# EAGLE design fMeter-preamp (EAGLE 5.07)
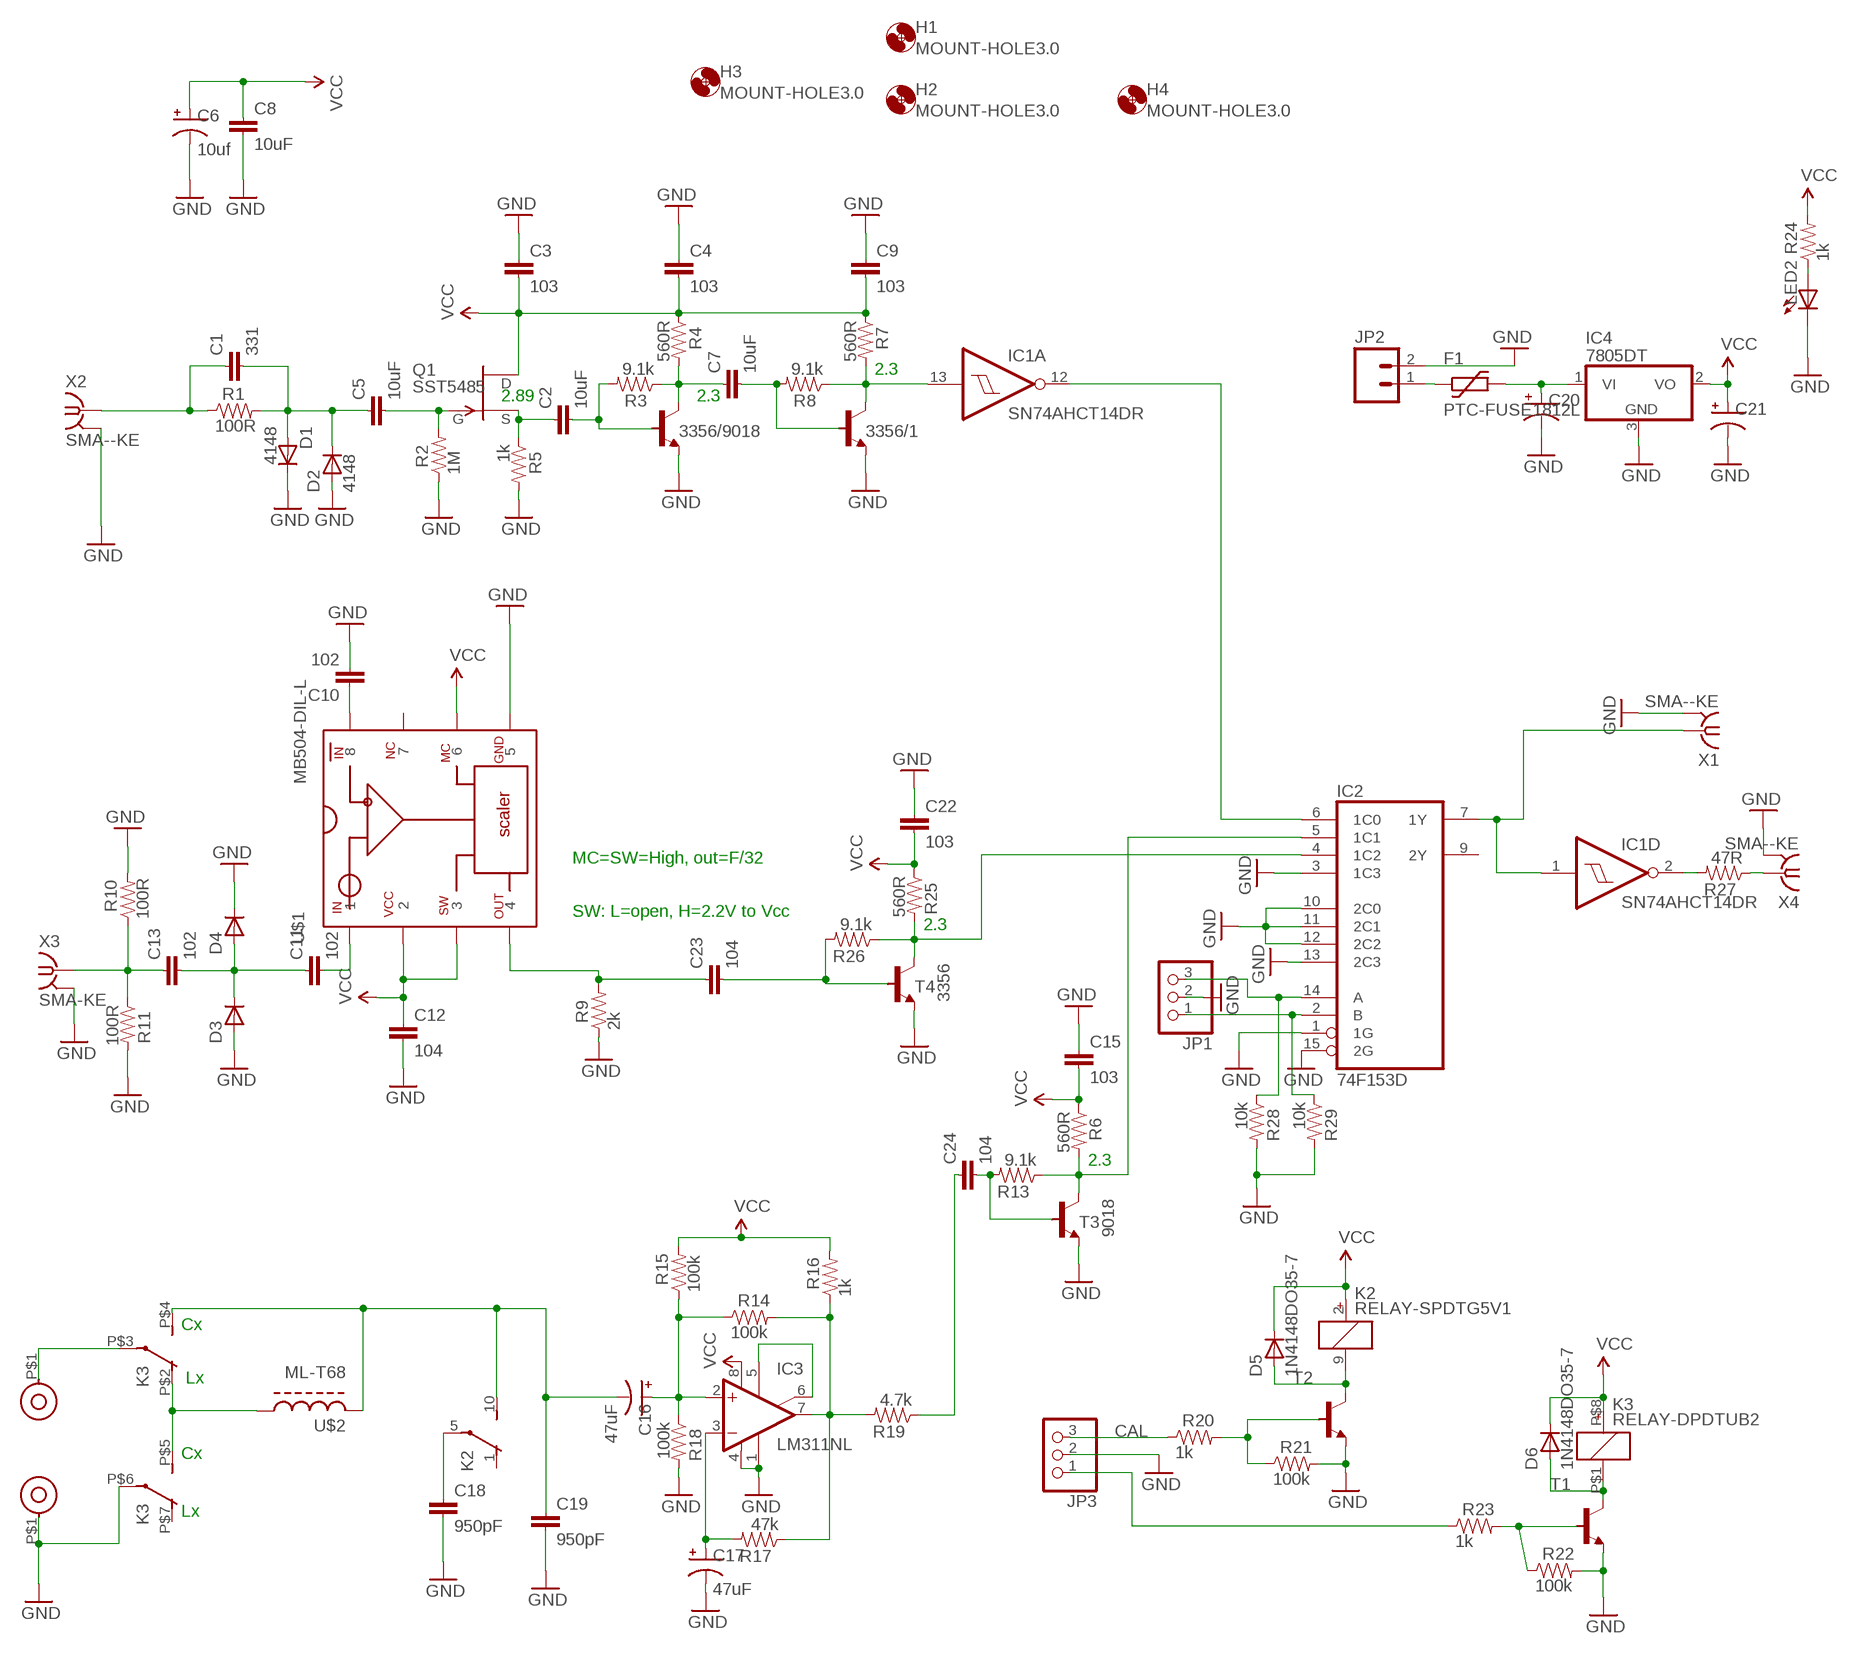
[diagram p0: schematic, sheet 1]

## Parts
3356/1  -NPN-SOT23-BEC  [SOT23-BEC]
3356/9018  -NPN-SOT23-BEC  [SOT23-BEC]
C1  331  CAP-C1206  [C1206]
C2  10uF  CAP-C1206  [C1206]
C3  103  CAP-C0805  [C0805]
C4  103  CAP-C0805  [C0805]
C5  10uF  CAP-C1206  [C1206]
C6  10uf  CAP_POL7343  [EIA7343]
C7  10uF  CAP-C0805  [C0805]
C8  10uF  CAP-C1206  [C1206]
C9  103  CAP-C0805  [C0805]
C10  102  CAP-C0805  [C0805]
C11  102  CAP-C0805  [C0805]
C12  104  CAP-C0805  [C0805]
C13  102  CAP-C0805  [C0805]
C15  103  CAP-C0805  [C0805]
C16  47uF  CAP_POL-CT6032  [CT6032]
C17  47uF  CAP_POL-CT6032  [CT6032]
C18  950pF  CAP-CB  [CB-1.3CM]
C19  950pF  CAP-CB  [CB-1.3CM]
C20  CAP_POL-CT6032  [CT6032]
C21  CAP_POL-CT6032  [CT6032]
C22  103  CAP-C0805  [C0805]
C23  104  CAP-C0805  [C0805]
C24  104  CAP-C0805  [C0805]
D1  4148  DIODE1206  [1206-DIODE]
D2  4148  DIODE1206  [1206-DIODE]
D3  DIODE1206  [1206-DIODE]
D4  DIODE1206  [1206-DIODE]
D5  1N4148DO35-7  DIODE1206  [1206-DIODE]
D6  1N4148DO35-7  DIODE1206  [1206-DIODE]
F1  PTC-FUSE1812L  [1812L]
H1  MOUNT-HOLE3.0  [3,0]
H2  MOUNT-HOLE3.0  [3,0]
H3  MOUNT-HOLE3.0  [3,0]
H4  MOUNT-HOLE3.0  [3,0]
IC1  SN74AHCT14DR  74HC14D  [SO14]
IC2  74F153D  74HC153D  [SO16]
IC3  LM311NL  [DIL-08]
IC4  7805DT  [TO252]
JP1  PINHD-1X3PTH  [1X03]
JP2  CON-02XH-V  [XH-1X2-LONG-LOCK-V]
JP3  PINHD-1X3PTH  [1X03]
K2  RELAY-SPDTG5V1  [G5V1]
K3  RELAY-DPDTUB2  [UB2-NU]
LED2  LED0805  [CHIPLED_0805]
Q1  SST5485  [SOT23]
R1  100R  RESISTOR-R0805W  [R0805W]
R2  1M  RESISTOR-R0805W  [R0805W]
R3  9.1k  RESISTOR0805  [0805]
R4  560R  RESISTOR-R0805W  [R0805W]
R5  1k  RESISTOR-R0805W  [R0805W]
R6  560R  RESISTOR-R0805W  [R0805W]
R7  560R  RESISTOR-R0805W  [R0805W]
R8  9.1k  RESISTOR-R0805W  [R0805W]
R9  2k  RESISTOR0805  [0805]
R10  100R  RESISTOR0805  [0805]
R11  100R  RESISTOR0805  [0805]
R13  9.1k  RESISTOR-R0805W  [R0805W]
R14  100k  RESISTOR-R0805W  [R0805W]
R15  100k  RESISTOR-R0805W  [R0805W]
R16  1k  RESISTOR-R0805W  [R0805W]
R17  47k  RESISTOR-R0805W  [R0805W]
R18  100k  RESISTOR-R0805W  [R0805W]
R19  4.7k  RESISTOR-R0805W  [R0805W]
R20  1k  RESISTOR-R0805W  [R0805W]
R21  100k  RESISTOR-R0805W  [R0805W]
R22  100k  RESISTOR-R0805W  [R0805W]
R23  1k  RESISTOR-R0805W  [R0805W]
R24  1k  RESISTOR-R0805W  [R0805W]
R25  560R  RESISTOR-R0805W  [R0805W]
R26  9.1k  RESISTOR-R0805W  [R0805W]
R27  47R  RESISTOR-R0805W  [R0805W]
R28  10k  RESISTOR-R0805W  [R0805W]
R29  10k  RESISTOR-R0805W  [R0805W]
T1  -NPN-SOT23-BEC  [SOT23-BEC]
T2  -NPN-SOT23-BEC  [SOT23-BEC]
T3  9018  -NPN-SOT23-BEC  [SOT23-BEC]
T4  3356  -NPN-SOT23-BEC  [SOT23-BEC]
U$1  MB504-DIL-L  [DIP08-L]
U$2  ML-T68  [T68-PIN2]
U$3  SOCK  [SOCK-5MM]
U$4  SOCK  [SOCK-5MM]
X1  SMA--KE  [SMA-KE]
X2  SMA--KE  [SMA-KE]
X3  SMA-KE  SMA-142-0711-821/826  [J502-ND-142-0711-821/826]
X4  SMA--KE  [SMA-KE]

## Nets
CAL: JP3.3 R20.1
GND: 3356/1.E 3356/9018.E C3.1 C4.1 C6.C(-) C8.2 C9.1 C10.2 C12.2 C15.1 C17.- C18.2 C19.2 C20.- C21.- C22.1 D1.K(C) D2.A D3.A D4.K(C) IC2.1(1G) IC2.3(1C3) IC2.10(2C0) IC2.11(2C1) IC2.12(2C2) IC2.13(2C3) IC2.15(2G) IC3.1(GND) IC3.4(V-) IC4.3(GND) JP1.2 JP2.2 JP3.2 K3.P$6(-2:P) LED2.C R2.1 R5.2 R9.1 R10.2 R11.2 R18.2 R21.2 R22.2 R28.2 R29.2 T1.E T2.E T3.E T4.E U$1.5 U$3.P$1 X1.G@1(GND) X2.G@1(GND) X3.G@1(GND) X4.G@1(GND)
N$1: C1.1 R1.1 X2.1
N$2: C1.2 C5.1 D1.A D2.K(C) R1.2
N$3: C2.1 Q1.2(S) R5.1
N$4: 3356/9018.B C2.2 R3.2
N$5: 3356/9018.C C7.1 R3.1 R4.2
N$6: C5.2 Q1.3(G) R2.2
N$7: 3356/1.C IC1.13(A:I) R7.2 R8.1
N$8: IC1.1(D:I) IC2.7(1Y) X1.1
N$9: 3356/1.B C7.2 R8.2
N$10: C10.1 U$1.8
N$11: C11.2 U$1.1
N$12: C11.1 C13.2 D3.K(C) D4.A
N$13: IC1.12(A:O) IC2.6(1C0)
N$14: C13.1 R10.1 R11.1 X3.1
N$15: C16.+ IC3.2(+IN) R14.1 R15.1 R18.1
N$16: IC3.7(OUT) R14.2 R16.1 R17.1 R19.2
N$17: IC3.5(ON) IC3.6(ON/STR)
N$18: C17.+ IC3.3(-IN) R17.2
N$19: C16.- C19.1 K2.10(2:S) K3.P$4(-1:S) U$2.4
N$20: IC1.2(D:O) R27.2
N$22: C18.1 K2.5(2:P)
N$23: D5.A K2.9 T2.C
N$24: R20.2 R21.1 T2.B
N$25: K3.P$3(-1:P) U$4.P$1
N$26: K3.P$2(-1:O) K3.P$5(-2:S) U$2.3
N$27: D6.A K3.P$1 T1.C
N$28: IC2.2(B) JP1.1 R29.1
N$29: C20.+ F1.P$2 IC4.1(VI)
N$30: R22.1 R23.2 T1.B
N$31: JP3.1 R23.1
N$32: C24.2 R13.2 T3.B
N$33: F1.P$1 JP2.1
N$34: LED2.A R24.1
N$35: IC2.5(1C1) R6.2 R13.1 T3.C
N$36: C23.1 R9.2 U$1.4
N$37: IC2.4(1C2) R25.2 R26.1 T4.C
N$38: C23.2 R26.2 T4.B
N$39: C24.1 R19.1
N$40: IC2.14(A) JP1.3 R28.1
N$41: R27.1 X4.1
VCC: C3.2 C4.2 C6.A(+) C8.1 C9.2 C12.1 C15.2 C21.+ C22.2 D5.K(C) D6.K(C) IC3.8(V+) IC4.2(VO) K2.2 K3.P$8 Q1.1(D) R4.1 R6.1 R7.1 R15.2 R16.2 R24.2 R25.1 U$1.2 U$1.3 U$1.6
Unconnected: IC1.3(E:I) IC1.4(E:O) IC1.5(F:I) IC1.6(F:O) IC1.8(C:O) IC1.9(C:I) IC1.10(B:O) IC1.11(B:I) IC2.9(2Y) K2.1(2:O) K3.P$7(-2:O) U$1.7

## Notes on the sheet
- 2.3
- 2.89 | 2.3
- MC=SW=High, out=F/32
- SW: L=open, H=2.2V to Vcc
- 2.3
- 2.3
- Cx
- Lx
- Cx
- Lx

## Power pins joined to a net without a drawn wire
GND: IC1.7(P:GND) IC2.8(GND) X1.G@2(GND) X1.G@3(GND) X1.G@4(GND) X2.G@2(GND) X2.G@3(GND) X2.G@4(GND) X3.G@2(GND) X3.G@3(GND) X3.G@4(GND) X4.G@2(GND) X4.G@3(GND) X4.G@4(GND)
VCC: IC1.14(P:VCC) IC2.16(VCC)

## Library data of the parts
3356/1 3356/9018 T1-T4 = digital-toy:*-NPN-: NPN Transistror most of sot-23 use the pacages sot23-BEC, top C, left B, right E. by hyl, digital-toy. and to-92 use ebc(from-top) by hyl, digital-toy.
C1-C5 C7-C13 C15 C18 C19 C22-C24 = digital-toy:CAP: Capacitor Standard 0603 ceramic capacitor, and 0.1" leaded capacitor.
C6 C16 C17 C20 C21 = digital-toy:CAP_POL: Capacitor Polarized These are standard SMD and PTH capacitors. Normally 10uF, 47uF, and 100uF in electrolytic and tantalum varieties. Always verify the external diameter of the through hole cap, it varies with capacity, voltage, and manufacturer. The EIA devices should be standard. PANASONIC_D size: 6.5mmx6.5mmx5.5mm, 100uf (taobao:6.3mmx5.5mm), same as CVL0605 153cvl0405 size: 4mmx4mmx5.5mm, 10uf (taobao:4mmx5.5mm) ct6032 typical 47uF Tantalum, comment by hyl.
D1-D6 = digital-toy:DIODE: Diode These are standard reverse protection diodes and small signal diodes. SMA package can handle up to about 1A. SOD-323 can handle about 200mA. What the SOD-323 package when ordering, there are some mfgs out there that are 5-pin packages.
F1 = digital-toy:PTC-FUSE
H1-H4 = holes:MOUNT-HOLE: MOUNTING HOLE with drill center marker
IC1 = 74xx-eu:74*14: Hex schmitt trigger INVERTER
IC2 = 74xx-eu:74*153: Dual 4-line to 1-line data SELECTOR/MULTIPLEXER
IC3 = digital-toy:LM311: COMPARATOR
IC4 = linear:78*: Positive VOLTAGE REGULATOR Source: http://cache.national.com/ds/LM/LM78L05.pdf http://www.fairchildsemi.com/ds/LM/LM7805.pdf
JP1 JP3 = digital-toy:PINHD-1X3: PIN HEADER
JP2 = digital-toy:CON-02: Header 2 Standard 2-pin 0.1" header. Use with straight break away headers (SKU : PRT-00116), right angle break away headers (PRT-00553), swiss pins (PRT-00743), machine pins (PRT-00117), and female headers (PRT-00115). Molex polarized connector foot print use with SKU : PRT-08233 with associated crimp pins and housings.
K2 = digital-toy:RELAY-SPDT: Miniature Power PCB Relay SCHRACK 1pole 10 A Source: http://www.schrack.com/.. 5847.pdf
K3 = digital-toy:RELAY-DPDT: Note NEC coil has polarity KLEIN RELAIS WASCHDICHT 2 Wechsler Distriibutor: Conrad Electronic, Bestell Nr.: 505226-13 - 24V 505226-13 - 5V 505170-13 - 12V 505170-13 - 48V Bestar Electric Ltd. Source: http://www2.produktinfo.conrad.com/datenblaetter/500000-524999/505226-da-01-en-Kleinrelais_waschdicht_24V.pdf
LED2 = digital-toy:LED: LEDs Standard schematic elements and footprints for 5mm, 3mm, 1206, and 0603 sized LEDs. 5mm - Spark Fun Electronics SKU : COM-00529 (and others) copy led.lbr 0805 led here, by hyl digital-toy. 2010.6.29
Q1 = transistor-fet:?548*: N-Channel JFETs Source: VISHAY 2N5484.pdf Compatible: TO92 2N5245 J304 J305 U310 J308 J309 J310 TO72 2N4416 2N4416A 2N3823 2N4351 3N169 3N170 3N171 MFE3002 TO18 2N3796 2N3797 MFE825 Source: Motorola European Master Guide Pacge 3-59
R1-R11 R13-R29 = digital-toy:RESISTOR: Resistor Basic schematic elements and footprints for 0603, 1206, and PTH 1/10th watt (small) resistors. digital-toy copy vertical mount of axial-0.3 from rcl.lbr : the 0207/xx 3W resistor: 0617/17, 0617/22, 0617V
U$1 = dtoy-RF:MB504: MB501/504 by hyl 2011.4.8
U$2 = dtoy-RF:ML
U$3 U$4 = digital-toy:SOCK
X1 X2 X4 = dtoy-RF:SMA-: SMA 50 Ohm End Launch Jack Receptacle - Round Contact Johnson Components Source: www.johnsoncomponents.com .. J502-ND.pdf
X3 = con-coax:SMA-: SMA 50 Ohm End Launch Jack Receptacle - Round Contact Johnson Components Source: www.johnsoncomponents.com .. J502-ND.pdf

## Board
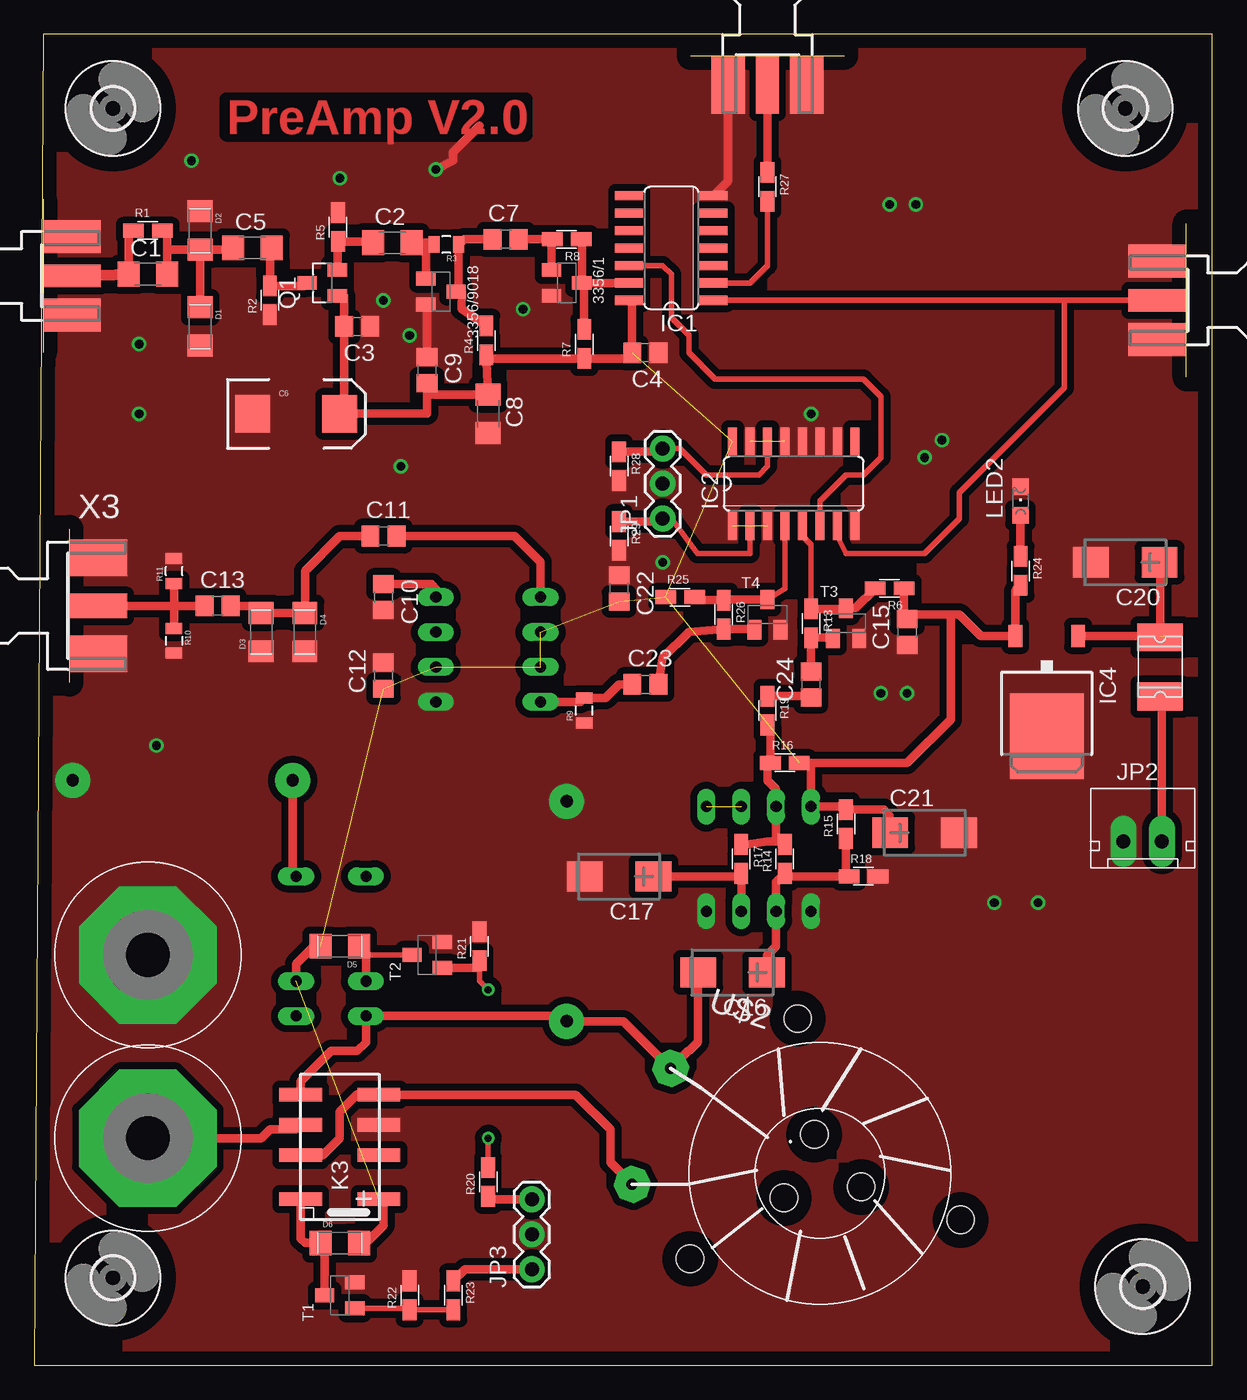
[diagram p1: board, top side]
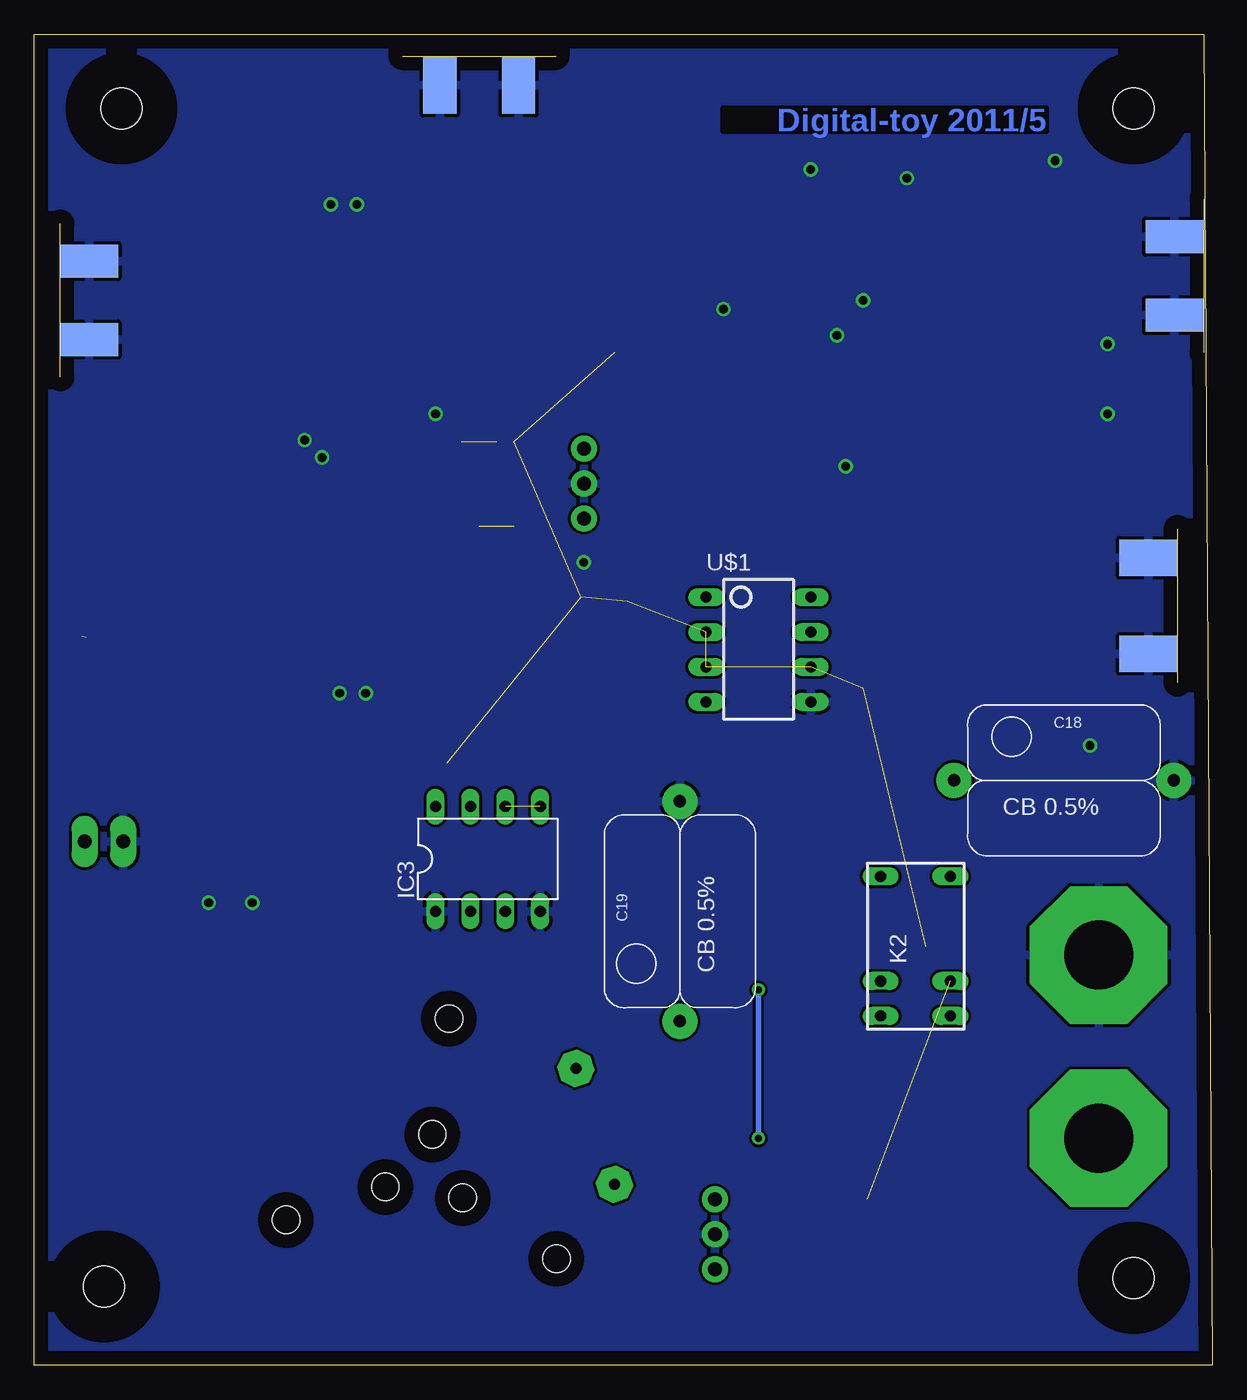
[diagram p2: board, bottom side, seen from below]

Size 85.7 x 96.83 mm. Coordinates in mm from the lower left corner, seen from the top.
Outline: 0,0 85.7,0 85.7,96.83 0.64,96.83 0,0
Copper layers (1*16): Top 0.035mm / dielectric 1.5mm / Bottom 0.035mm
Design rules "default": minimum track width 10mil, minimum drill 24mil, track to track 8mil, track to pad 8mil, pad to pad 8mil, via to via 8mil, smd to smd 8mil, copper to edge 40mil, drill to drill 8mil, minimum pad ring 10mil, minimum via ring 8mil, stop-mask expansion 4mil, vias tented up to drill 0mil, thermal gap 10mil

### Footprints (pad centres in the part's own frame; a part is rotated, then mirrored left to right if it is on the bottom)
SOT23-BEC = smd 1 x 1.4: B -0.95,-1.1; C 0,1.1; E 0.95,-1.1
C1206 = smd 1.6 x 1.8: 1 -1.4,0; 2 1.4,0
C0805 = smd 1.3 x 1.5: 1 -0.95,0; 2 0.95,0
EIA7343 = smd 2.55 x 2.7: A 3.17,0; C -3.17,0
CT6032 = smd 2.6 x 2.2: + -2.5,0; - 2.5,0
CB-1.3CM = drill 0.9 pad 2.54 round: 1 -8,0; 2 8,0
1206-DIODE = smd 1.6 x 1.8: A -1.4,0; K 1.4,0
1812L = smd 2.03 x 3.3: P$1 -2.16,0; P$2 2.16,0
3,0 = hole 3: 0,0
SO14 = smd 0.66 x 2.032: 1 -3.81,-3.073; 2 -2.54,-3.073; 3 -1.27,-3.073; 4 0,-3.073; 5 1.27,-3.073; 6 2.54,-3.073; 7 3.81,-3.073; 8 3.81,3.073; 9 2.54,3.073; 10 1.27,3.073; 11 0,3.073; 12 -1.27,3.073; 13 -2.54,3.073; 14 -3.81,3.073
SO16 = smd 0.66 x 2.032: 1 -4.445,-3.073; 2 -3.175,-3.073; 3 -1.905,-3.073; 4 -0.635,-3.073; 5 0.635,-3.073; 6 1.905,-3.073; 7 3.175,-3.073; 8 4.445,-3.073; 9 4.445,3.073; 10 3.175,3.073; 11 1.905,3.073; 12 0.635,3.073; 13 -0.635,3.073; 14 -1.905,3.073; 15 -3.175,3.073; 16 -4.445,3.073
DIL-08 = drill 0.813 long: 1 -3.81,-3.81; 2 -1.27,-3.81; 3 1.27,-3.81; 4 3.81,-3.81; 5 3.81,3.81; 6 1.27,3.81; 7 -1.27,3.81; 8 -3.81,3.81
TO252 = smd 1 x 1.6: 1 -2.28,-4.8; 2 2.28,-4.8 | smd 5.4 x 6.2: 3 0,2.5
1X03 = drill 1.016 pad 1.88 round: 1 0,0; 2 2.54,0; 3 5.08,0
XH-1X2-LONG-LOCK-V = drill 1.016 pad 1.88 long: 1 -1.397,0; 2 1.397,0
G5V1 = drill 0.813 long: 1 -5.08,-2.54; 2 -2.54,-2.54; 5 5.08,-2.54; 6 5.08,2.54; 9 -2.54,2.54; 10 -5.08,2.54
UB2-NU = smd 1 x 3.1: P$1 -3.8,2.85; P$2 -0.6,2.85; P$3 1.6,2.85; P$4 3.8,2.85; P$5 3.8,-2.85; P$6 1.6,-2.85; P$7 -0.6,-2.85; P$8 -3.8,-2.85
CHIPLED_0805 = smd 1.2 x 1.2: A 0,-1.05; C 0,1.05
SOT23 = smd 1 x 1.4: 1 -0.95,-1.1; 2 0.95,-1.1; 3 0,1.1
R0805W = smd 1.5 x 1: 1 -1.052,0; 2 1.052,0
0805 = smd 0.8 x 1.2: 1 -0.9,0; 2 0.9,0
DIP08-L = drill 0.813 long: 1 0,-2.54; 2 2.54,-2.54; 3 5.08,-2.54; 4 7.62,-2.54; 5 7.62,5.08; 6 5.08,5.08; 7 2.54,5.08; 8 0,5.08
T68-PIN2 = drill 0.8 pad 2.54 octagon: 3 12.7,5.08; 4 12.7,-3.81 | hole 2: 1.905,2.54; 6.985,8.89; 1.27,-2.54; 5.08,-10.16; -3.175,0; -10.795,0
SOCK-5MM = drill 5 pad 10 octagon: P$1 0,0
SMA-KE = smd 4.191 x 1.651: 1 2.115,0 | smd 4.191 x 2.413: G@1 2.115,2.86; G@2 2.115,-2.86 | smd 4.191 x 2.413 bottom: G@3 2.115,2.86; G@4 2.115,-2.86
J502-ND-142-0711-821/826 = smd 4.191 x 1.778: 1 2.115,0 | smd 4.191 x 2.667: G@1 2.115,3.495; G@2 2.115,-3.495 | smd 4.191 x 2.667 bottom: G@3 2.115,3.495; G@4 2.115,-3.495

### Placement (x,y rotation side)
3356/1  38.73,78.74 270 top
3356/9018  29.59,78.11 270 top
C1  8.26,79.38 0 top
C2  26.04,81.66 0 top
C3  23.5,75.56 180 top
C4  44.45,73.66 180 top
C5  15.88,81.28 0 top
C6  19.05,69.22 0 top
C7  34.29,81.92 0 top
C8  33.02,69.22 270 top
C9  28.57,72.39 270 top
C10  25.4,55.88 270 top
C11  25.4,60.33 0 top
C12  25.4,50.16 90 top
C13  13.34,55.24 0 top
C15  63.5,53.34 90 top
C16  50.8,28.57 180 top
C17  42.55,35.56 180 top
C18  10.79,42.55 0 bottom
C19  38.73,33.02 90 bottom
C20  79.38,58.42 180 top
C21  64.77,38.73 0 top
C22  42.55,56.52 270 top
C23  44.45,49.53 0 top
C24  56.52,49.53 90 top
D1  12.06,75.56 270 top
D2  12.06,82.55 270 top
D3  16.51,53.34 90 top
D4  19.68,53.34 270 top
D5  22.23,30.48 180 top
D6  22.23,8.89 0 top
F1  81.92,50.8 90 top
H1  5.71,6.35 0 top
H2  79.38,91.44 0 top
H3  5.71,91.44 0 top
H4  80.64,5.71 0 top
IC1  46.35,81.28 90 top
IC2  55.24,64.14 0 top
IC3  52.7,36.83 0 bottom
IC4  73.66,48.26 180 top
JP1  45.72,61.59 90 top
JP2  80.64,38.1 180 top
JP3  36.2,6.99 90 top
K2  21.59,30.48 90 bottom
K3  22.23,15.88 90 top
LED2  71.75,62.87 0 top
Q1  20.95,78.74 90 top
R1  8.26,82.55 0 top
R2  17.14,77.47 90 top
R3  29.97,81.53 180 top
R4  32.89,74.55 90 top
R5  22.1,82.8 90 top
R6  62.23,56.52 180 top
R7  40.01,74.3 90 top
R8  38.73,81.92 180 top
R9  40.01,47.62 90 top
R10  10.16,52.7 270 top
R11  10.16,57.78 90 top
R13  56.52,53.98 270 top
R14  54.61,36.83 90 top
R15  59.05,39.37 90 top
R16  54.61,43.81 0 top
R17  51.44,36.83 270 top
R18  60.33,35.56 0 top
R19  53.34,47.62 270 top
R20  33.02,13.34 90 top
R21  32.38,30.48 90 top
R22  27.3,5.08 90 top
R23  30.48,5.08 270 top
R24  71.75,57.78 270 top
R25  46.99,55.88 0 top
R26  50.16,54.61 270 top
R27  53.34,85.72 270 top
R28  42.55,65.41 270 top
R29  42.55,60.33 270 top
T1  22.23,5.08 90 top
T2  28.57,29.84 90 top
T3  59.05,53.98 0 top
T4  53.34,54.61 0 top
U$1  34.29,55.88 270 bottom
U$2  57.15,13.97 161.6 top
U$3  8.26,29.84 0 top
U$4  8.26,16.51 0 top
X1  83.82,77.47 180 top
X2  0.64,79.25 0 top
X3  2.54,55.24 0 top
X4  53.34,95.25 270 top

### Tracks (layer width: path | path; a pad name or v marks a point on that pad's centre or on a via)
CAL
  Top 0.61: JP3.3 33.24,12.06 R20.1
GND  (via drill 0.64)  (2 unrouted)
  Top 0.61: 32.38,90.17 30.48,88.27 30.48,87.63 v29.21,87 | C9.1 28.57,77.07 3356/9018.E | X4.G@4 50.48,86.14 IC1.7
  other vias: 11.43,87.63 22.23,86.36 7.62,69.22 7.62,74.3 35.56,76.83 27.3,74.93 25.4,77.47 26.67,65.41 64.77,66.04 66.04,67.31 62.23,84.45 64.14,84.45 69.85,33.66 73.03,33.66 61.59,48.9 63.5,48.9 8.89,45.09 56.52,69.22 45.72,58.42
  pour Top (isolate 0.508, no thermals): -10.79,106.05 92.71,106.68 93.34,41.27 92.71,3.81 93.34,-4.45 -10.16,-6.35 -10.16,87.63
  pour Bottom: -27.3,94.61 -27.3,100.33 -21.59,106.05 90.17,106.05 102.87,93.34 102.87,10.79 83.82,-8.26 -7.62,-8.26 -22.23,6.35 -22.23,90.17 -26.67,94.61
N$1
  Top 0.61: C1.1 6.86,82.2 R1.1
  Top 0.813: X2.1 C1.1
N$2
  Top 0.61: C1.2 9.65,81.28 | 9.65,81.28 9.65,82.42 9.53,82.55 R1.2 | D2.K 9.79,81.15 9.65,81.28 | D2.K D1.A | D2.K 14.35,81.15 C5.1
N$3
  Top 0.61: Q1.2 22.05,81.71 R5.1 24.54,81.75 C2.1
N$4
  Top 0.61: C2.2 28.57,81.66 | 28.57,81.66 28.95,81.66 R3.2 | 3356/9018.B 28.49,81.58 28.57,81.66
N$5
  Top 0.61: C7.1 31.25,81.92 R3.1 30.87,78.29 3356/9018.C 30.48,77.89 31.11,78.11 31.08,76.87 R4.2
N$6
  Top 0.61: C5.2 17.14,81.15 R2.2 19.64,78.52 Q1.3
N$7
  Top 0.61: R7.2 40.01,78.57 3356/1.C | 3356/1.C 39.84,81.87 R8.1 40.01,82.13 | 3356/1.C IC1.13
N$8
  Top 0.406: 74.93,77.47 IC1.1 | 74.93,77.47 X1.1 | IC2.7 58.42,60.33 59.05,59.05 64.77,59.05 67.31,61.59 67.31,63.5 74.93,71.12 74.93,77.47
N$9
  Top 0.61: 3356/1.B 37.63,81.87 R8.2 C7.2 34.92,81.92
N$10
  Top 0.61: C10.1 28.89,56.83 29.21,56.52 U$1.8
N$11
  Top 0.61: C11.2 34.92,60.33 36.83,58.42 U$1.1
N$12
  Top 0.61: C13.2 16,55.24 D3.K 19.05,54.74 | 19.05,54.74 D4.A | C11.1 22.23,60.33 19.68,57.78 19.68,55.38 19.05,54.74
N$13
  Top 0.406: IC2.6 57.15,62.87 59.05,64.77 60.33,64.77 61.59,66.04 61.59,70.48 60.33,71.75 49.53,71.75 47.62,73.66 47.62,74.93 46.35,76.2 46.35,79.38 45.72,80.01 IC1.12
N$14
  Top 0.61: X3.1 10.16,55.24 | 10.16,55.24 C13.1 | 10.16,55.24 R11.1 | 10.16,55.24 R10.1
N$15
  Top 0.61: R15.1 59.05,35.78 R18.1 54.83,35.56 R14.1 53.98,35.14 IC3.2 53.98,30.48 53.3,29.8 C16.+
N$16
  Top 0.61: R17.1 51.85,37.88 53.34,38.1 53.98,38.1 | 53.98,38.1 54.39,38.1 R14.2 | 53.98,38.1 IC3.7 53.98,41.91 53.34,42.55 53.34,43.6 R16.1 53.56,46.35 R19.2
N$17  (1 unrouted)
N$18
  Top 0.61: IC3.3 R17.2 51.02,35.56 C17.+
N$19
  Top 0.61: C16.- 48.3,23.54 47.62,22.86 47.57,22.86 U$2.4 42.88,25.02 C19.1 38.35,25.4 K2.10 24.13,23.5 23.5,22.86 21.59,22.86 19.38,20.64 K3.P$4
N$20
  Top 0.406: IC1.2 52.07,78.74 53.34,80.01 R27.2
N$22
  Top 0.61: C18.1 18.8,35.81 K2.5
N$23
  Top 0.406: 24.13,29.84 T2.C
  Top 0.61: K2.9 24.13,29.84 24.13,29.98 D5.A
N$24  (via drill 0.51)
  Top 0.406: v33.02,27.3 32.38,27.94 R21.1 | R20.2 v33.02,16.51
  Top 0.61: T2.B 32.28,28.89 R21.1
  Bottom 0.406: v33.02,16.51 v33.02,27.3
N$25
  Top 0.61: U$4.P$1 16.51,16.51 17.14,17.14 19.05,17.14 K3.P$3
N$26
  Top 0.61: K3.P$2 20.99,15.28 22.23,16.51 22.23,18.41 23.5,19.68 25.07,19.68 K3.P$5 39.38,19.68 41.91,17.14 41.91,14.74 U$2.3
N$27
  Top 0.61: T1.C 21.12,8.59 D6.A 19.68,8.89 19.38,9.2 K3.P$1
N$28
  Top 0.406: JP1.1 46.35,61.59 48.26,59.05 52.07,59.05 IC2.2
  Top 0.61: R29.1 45.5,61.38 JP1.1
N$29  (1 unrouted)
  Top 0.61: IC4.1 82.27,53.06 82.55,53.34 | F1.P$2 81.92,58.38 C20.+
N$30
  Top 0.406: T1.B 27.2,4.13 R22.1 R23.2
N$31
  Top 0.61: JP3.1 31.33,6.99 R23.1
N$32
  Top 0.61: C24.2 R13.2 58.06,52.92 T3.B
N$33
  Top 0.61: JP2.1 82.04,48.51 F1.P$1
N$34
  Top 0.61: R24.1 LED2.A
N$35
  Top 0.406: R13.1 56.52,59.69 55.88,60.33 IC2.5
  Top 0.61: R13.1 59.01,55.03 T3.C 59.74,55.08 R6.2
N$36
  Top 0.61: U$1.4 39.74,48.26 R9.2 41.54,48.52 42.55,49.53 C23.1
N$37
  Top 0.406: IC2.4 54.61,56.52 T4.C
  Top 0.61: T4.C 50.21,55.71 R26.1 48.26,55.66 R25.2
N$38
  Top 0.61: C23.2 45.72,51.44 47.62,53.34 R26.2 52.34,53.56 T4.B
N$39
  Top 0.61: R19.1 56.42,48.68 C24.1
N$40
  Top 0.406: JP1.3 46.99,66.67 48.9,64.77 52.7,64.77 53.34,65.41 IC2.14
  Top 0.61: R28.1 45.5,66.46 JP1.3
N$41
  Top 0.61: R27.1 X4.1
VCC  (10 unrouted)
  Top 0.61: Q1.1 22.54,77.79 C3.2 22.55,69.54 C6.A 28.57,69.22 28.57,70.48 | 32.91,72.99 C8.1 28.7,70.61 28.57,70.48 | 32.91,72.99 R4.1 | 28.57,70.48 C9.2 | 32.91,72.99 33.16,73.24 R7.1 43.08,73.24 C4.2 43.5,77.25 IC1.14 | K2.2 19.05,29.21 20.32,30.48 D5.K | R24.2 71.38,56.36 IC4.2 68.86,53.06 67.31,54.61 66.67,54.61 | 66.67,54.61 63.82,54.61 C15.2 63.28,54.51 R6.1 | 56.52,43.81 IC3.8 58.84,40.64 R15.2 61.81,40.42 62.23,40.01 62.23,38.77 C21.+ | 56.52,43.81 R16.2 | 56.52,43.81 63.5,43.81 66.67,46.99 66.67,54.61 | D6.K 24.13,8.89 25.4,10.16 25.4,11.75 K3.P$8

### Text on the board
Top: PreAmp V2.0
Bottom: Digital-toy 2011/5